# EasyEDA Pro project 仿生青蛙驱动控制板-STM32F1.eprj

# Schematic Schematic1
Create Date: 2024-03-05; Page Name: P1; Project Name: 仿生青蛙驱动控制板-STM32F1; Schematic Name: Schematic1; Update Date: 2024-03-06; Company: 嘉立创EDA; Page Size: A4; Version: V1.0
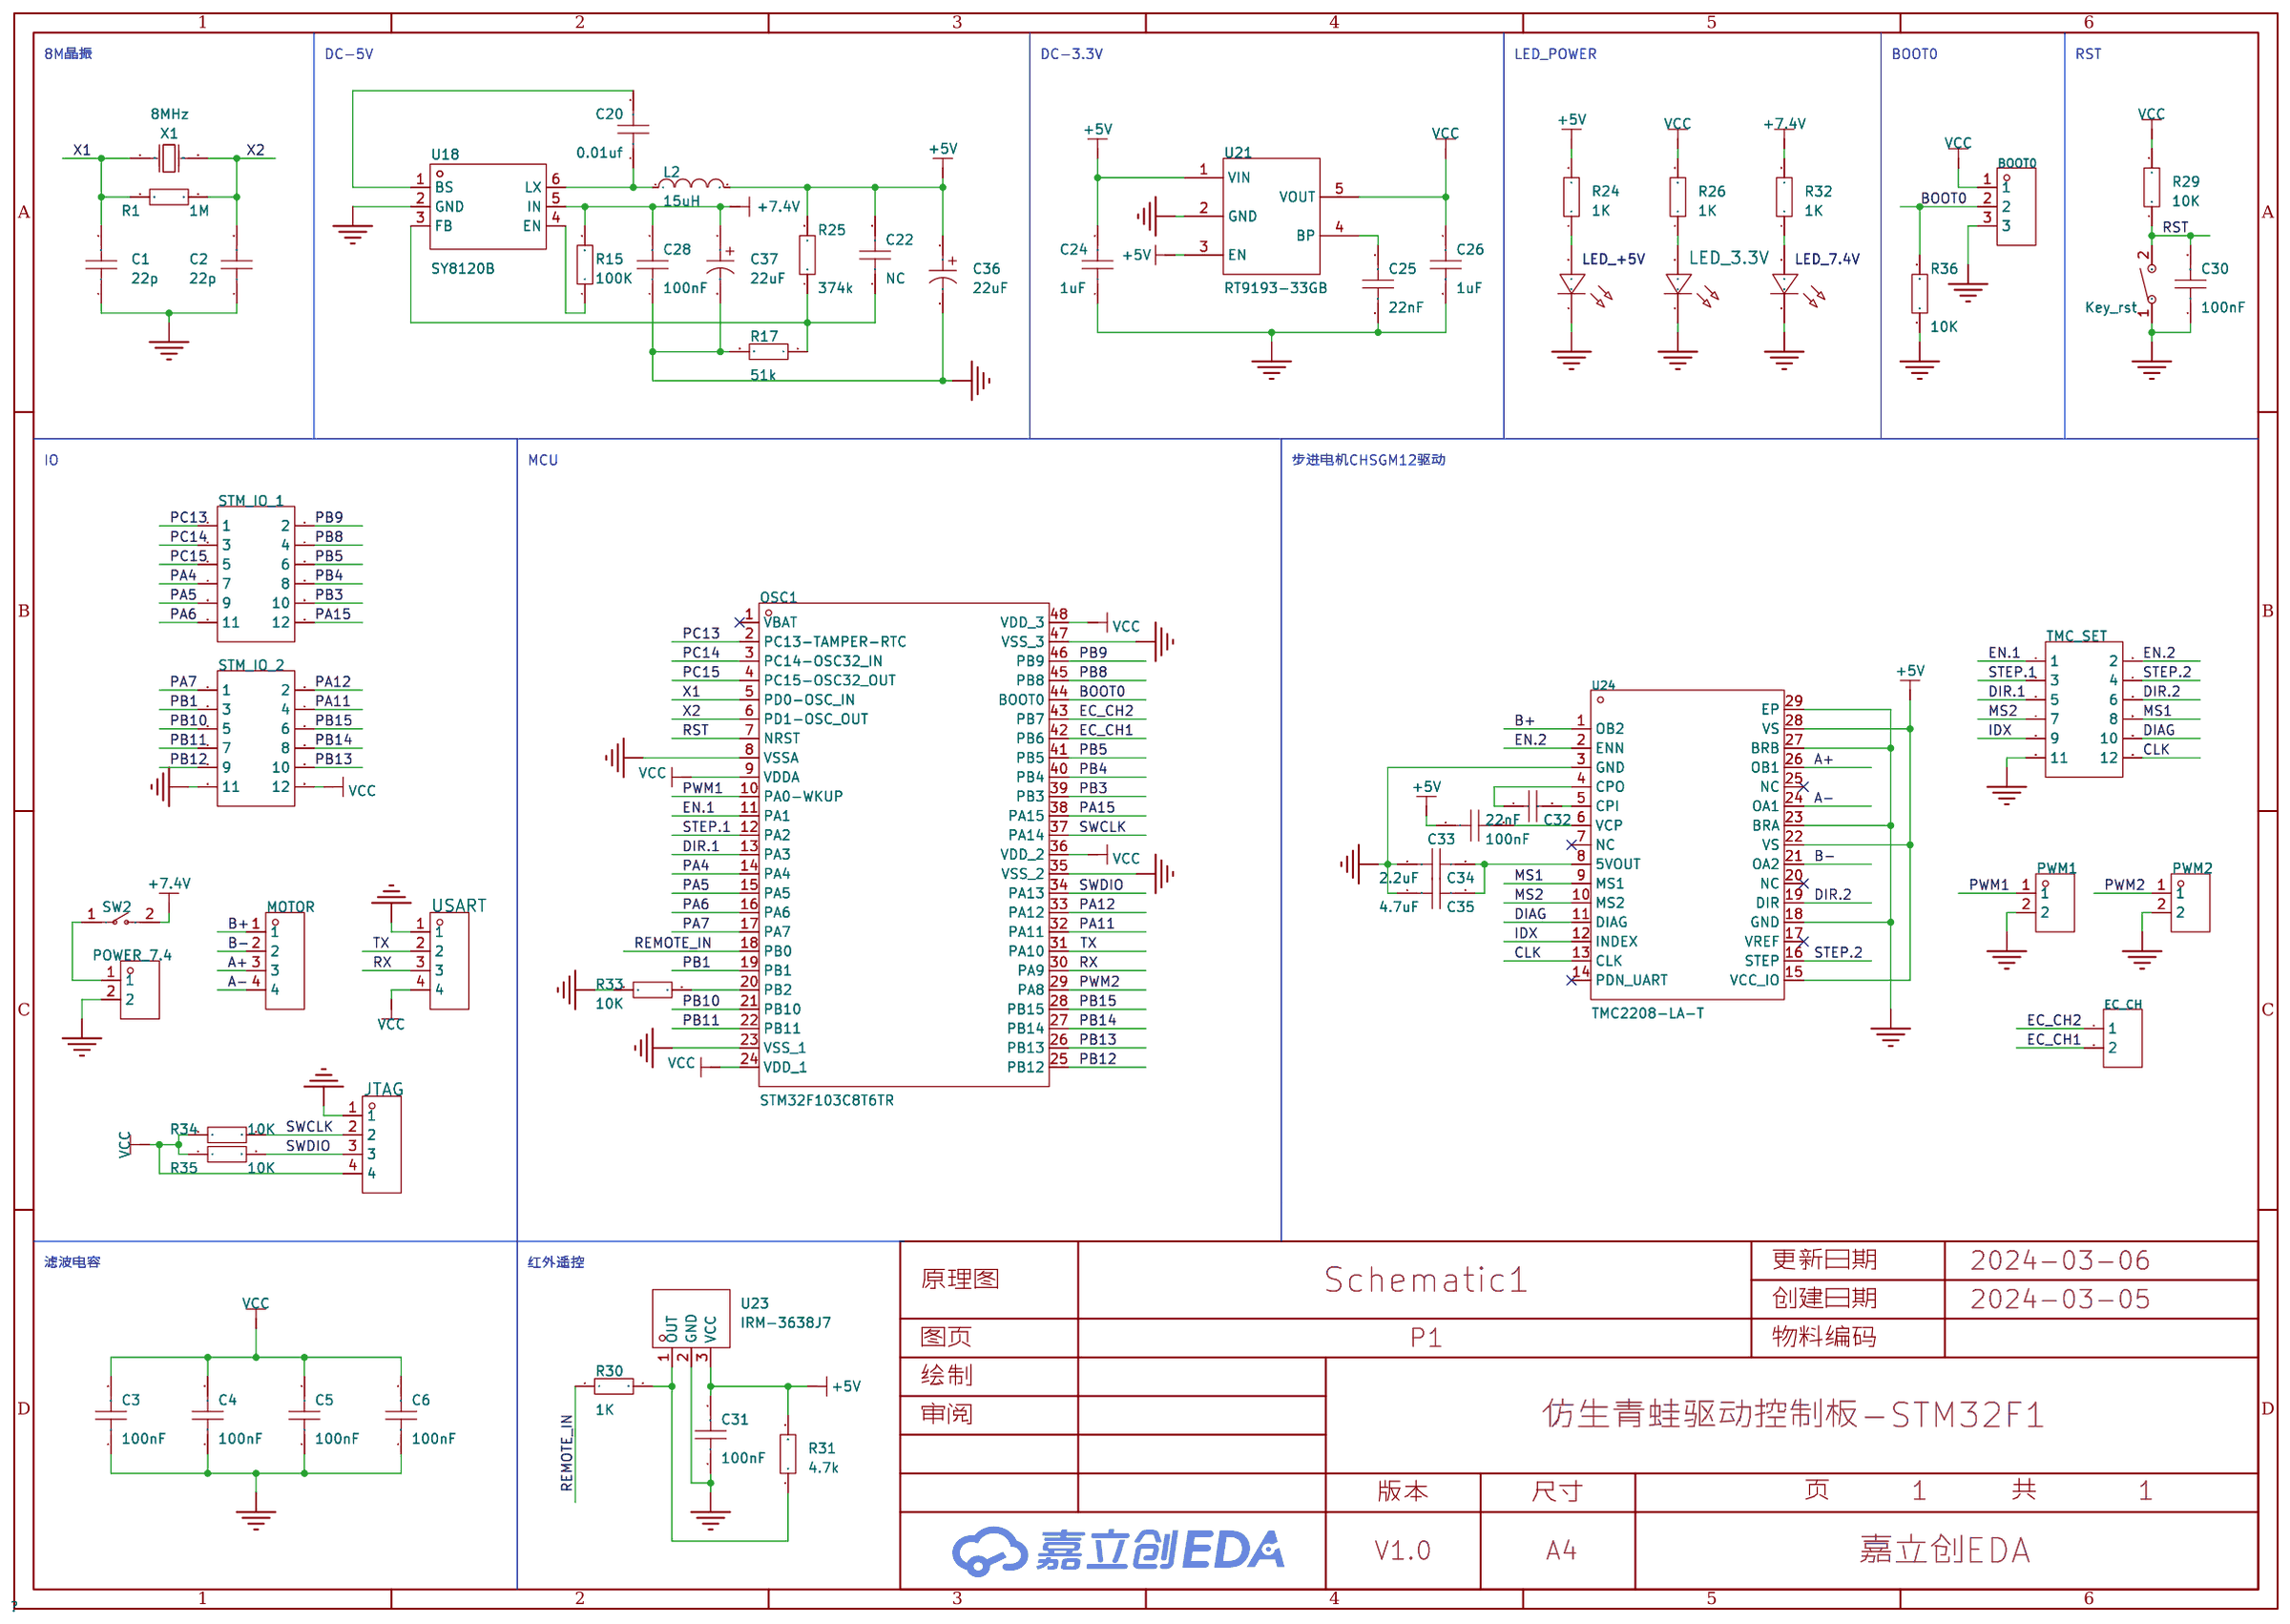
[diagram p0: schematic sheet]

## Parts
BOOT0  -  [HDR-TH_3P-P2.54-V-F]
C1  22p  [c0603]
C2  22p  [c0603]
C3  100nF  [c0603]
C4  100nF  [c0603]
C5  100nF  [c0603]
C6  100nF  [c0603]
C20  0.01uf  [c0603]
C22  NC  [c0603]
C24  1uF  [c0603]
C25  22nF  [c0603]
C26  1uF  [c0603]
C28  100nF  [c0603]
C30  100nF  [c0603]
C31  100nF  [c0603]
C32  22nF  [c0603]
C33  100nF  [c0603]
C34  2.2uF  [c0603]
C35  4.7uF  [c0603]
C36  22uF  [CAP-SMD_BD5.0-L5.3-W5.3-LS6.0-FD]
C37  22uF  [CAP-SMD_BD5.0-L5.3-W5.3-LS6.0-FD]
EC_CH  -  [HDR-TH_2P-P2.54-V-F]
JTAG  -  [HDR-TH_4P-P2.54-V-F]
Key_rst  TS-1092S-B3D2-G  [SW-SMD_L6.1-W3.6-LS7.9]
L2  15uH  [IND-SMD_L7.0-W6.6_FXL0630]
LED_3.3V  -  [LED_0603]
LED_7.4V  -  [LED_0603]
LED_+5V  -  [LED_0603]
MOTOR  ZX-XH2.54-4PZZ  [CONN-TH_4P-P2.50_4PIN]
OSC1  STM32F103C8T6TR  [LQFP-48_L7.0-W7.0-P0.50-LS9.0-BL]
POWER_7.4  ZX-XH2.54-2PZZ  [CONN-TH_2P-P2.50_HX25003-2A]
PWM1  ZX-XH2.54-2PZZ  [CONN-TH_2P-P2.50_HX25003-2A]
PWM2  ZX-XH2.54-2PZZ  [CONN-TH_2P-P2.50_HX25003-2A]
R1  1M  [r0603]
R15  100K  [r0603]
R17  51k  [r0603]
R24  1K  [r0603]
R25  374k  [r0603]
R26  1K  [r0603]
R29  10K  [r0603]
R30  1K  [r0603]
R31  4.7k  [r0603]
R32  1K  [r0603]
R33  10K  [r0603]
R34  10K  [r0603]
R35  10K  [r0603]
R36  10K  [r0603]
STM_IO_1  -  [HDR-TH_12P-P2.54-V-M-R2-C6-S2.54]
STM_IO_2  -  [HDR-TH_12P-P2.54-V-M-R2-C6-S2.54]
SW2  KCD11-2P-R  [SW-TH_2P-L15.0-W10.5-P5.00_KCD11-2P-R]
TMC_SET  -  [HDR-TH_12P-P2.54-V-M-R2-C6-S2.54]
U18  SY8120B  [SOT-23-6_L2.9-W1.6-P0.95-LS2.8-BL]
U21  RT9193-33GB  [SOT-23-5_L3.0-W1.7-P0.95-LS2.8-BL]
U23  IRM-3638J7  [OPTO-TH_IRM-3638MF56]
U24  TMC2208-LA-T  [QFN-28_L5.0-W5.0-P0.50-BL-EP]
USART  -  [HDR-TH_4P-P2.54-V-F]
X1  8MHz  [CRYSTAL-SMD_L5.0-W3.2]

## Library data of the parts
BOOT0 = HDR-F_2.54_1x3P: Supplier Part: C541850; Supplier Footprint: 插件
C1-C6 C24-C26 C28 C30 C31 C33-C35 = CAP_0402: Supplier Footprint: 0402
C20 C22 = CAP_0805: Supplier Footprint: 0805
C32 = 0603B223K500NT: 容值:22nF;精度:±10%;额定电压:50V;材质(温度系数):X7R;; LCSC Part Name: 22nF ±10% 50V; Supplier Part: C77571; Manufacturer: FH(风华); Supplier Footprint: 0603; JLCPCB Part Class: Extended Part; Datasheet: https://atta.szlcsc.com/upload/public/pdf/source/20200305/C486355_26A10D38EF8C2A5C37091D0039909270.pdf; Supplier: LCSC; Tolerance: ±10%; Voltage Rated: 50V; Temperature Coefficient: X7R
C36 C37 = RVT22UF25V67RV0047: 容值:22uF;精度:±20%;额定电压:25V;纹波电流:26mA@120Hz;等效串联电阻:-;; LCSC Part Name: 22uF ±20% 25V; Supplier Part: C2895283; Manufacturer: KNSCHA(科尼盛); Supplier Footprint: SMD,D5xL5.4mm; JLCPCB Part Class: Extended Part; Datasheet: https://atta.szlcsc.com/upload/public/pdf/source/20210913/932E3E330BEA7074461466B23B823DC6.pdf; Supplier: LCSC; Tolerance: ±20%; Rated Voltage: 25V; Ripple Current: 26mA@120Hz; φD: 5mm; L: 5.4mm; Lifetime @ Temp: 2000hrs@105℃; Operating Temperature: -55℃~+105℃
EC_CH = HDR-F_2.54_1x2P: Supplier Part: C49661; Supplier Footprint: 插件
JTAG USART = HDR-F_2.54_1x4P: Supplier Part: C2718488; Supplier Footprint: 插件
Key_rst = TS-1092S-B3D2-G: 电路结构:单刀单掷;按钮形状:矩形按钮;作用力:250gf;安装方式:立贴;开关长度:6.1mm;开关宽度:3.6mm;开关高度:2.5mm;带支架:不带;机械寿命:-;; LCSC Part Name: 6.1*3.6*2.5mm 立贴 轻触开关; Supplier Part: C520860; Manufacturer: Yuandi(元迪); Supplier Footprint: SMD; JLCPCB Part Class: 扩展库; Datasheet: https://atta.szlcsc.com/upload/public/pdf/source/20200424/C520860_DA5AE47D9A9DC527FC720B5FF0895739.pdf; Supplier: LCSC; Circuit: 单刀单掷; Actuator Style: 矩形按钮; Operating Force: 250gf; Mounting Style: 立贴; Switch Length: 6.1mm; Switch Width: 3.6mm; Switch Height: 2.5mm; Strike Gundam: 不带; Actuator/Cap Color: 灰色; Pin Style: 鸥翼型
L2 = FXL0630-150-M: 电感值:15uH;精度:±20%;额定电流:3A;饱和电流(Isat):4.5A;类型:一体成型电感;; LCSC Part Name: 15uH ±20% 4.5A; Supplier Part: C177243; Manufacturer: cjiang(长江微电); Supplier Footprint: SMD,6.6x7mm; JLCPCB Part Class: 扩展库; Datasheet: https://atta.szlcsc.com/upload/public/pdf/source/20230516/3A080F5AF8C87BB81C3BA86E5F60E51A.pdf; Supplier: LCSC; Tolerance: ±20%; Rated Current: 3A; Saturation Current (Isat): 4.5A; DC Resistance (DCR): 115mΩ; Type: 一体成型电感
LED_3.3V = LED_0402-R: Supplier Footprint: 0402
LED_7.4V = LED_0402-B: Supplier Footprint: 0402
LED_+5V = LED_0603-G: Supplier Footprint: 0603
MOTOR = ZX-XH2.54-4PZZ: 插针结构:1x4P;间距:2.54mm;安装方式:直插;参考系列:XH;总PIN数:4P;排数:1;每排PIN数:4;行距:-;额定电流:3A;触头材质:黄铜;触头镀层:锡;工作温度范围:-25℃~+85℃;; Supplier Part: C7429634; Manufacturer: Megastar(兆星); Supplier Footprint: 插件,P=2.54mm; JLCPCB Part Class: Extended Part; Datasheet: https://atta.szlcsc.com/upload/public/pdf/source/20230619/B529A2163E0159A644AB3383D208FB03.pdf; Supplier: LCSC; Pins Structure: 1x4P; Pitch: 2.54mm; Mounting Style: 直插; Reference Series: XH; Number of Pins: 4P; Number of Rows: 1; Number of PINs Per Row: 4; Current Rating (Max): 3A; Contact Material: 黄铜; Contact Plating: 锡; Operating Temperature Range: -25℃~+85℃
OSC1 = STM32F103C8T6TR: CPU内核:CM3;程序存储容量:64KB;RAM总容量:20KB;GPIO端口数量:37;工作电压范围:2V~3.6V;CPU最大主频:72MHz;程序存储器类型:-;; Supplier Part: C2969777; Manufacturer: ST(意法半导体); Supplier Footprint: LQFP-48(7x7); JLCPCB Part Class: 扩展库; Datasheet: https://atta.szlcsc.com/upload/public/pdf/source/20220628/95EE8CB51361BFD20205E6D0986143A8.pdf; Supplier: LCSC; CPU Core: CM3; Program Storage Size: 64KB; RAM Size: 20KB; GPIO Ports Number: 37; Operating Voltage Range: 2V~3.6V; CPU Maximum Speed: 72MHz; Operating Temperature Range: -40℃~+85℃; ADC (Bit): 12bit; Universal Serial Bus: 有; Peripheral/Function: 温度传感器; Watchdog: 有; Infrared Data Association: 有; Low-Voltage Detect: 有; Direct Memory Access: 有; Internal Oscillator: 有
POWER_7.4 PWM1 PWM2 = ZX-XH2.54-2PZZ: 插针结构:1x2P;间距:2.54mm;安装方式:直插;参考系列:XH;总PIN数:2P;排数:1;每排PIN数:2;行距:-;额定电流:3A;触头材质:黄铜;触头镀层:锡;工作温度范围:-25℃~+85℃;; Supplier Part: C7429632; Manufacturer: Megastar(兆星); Supplier Footprint: 插件,P=2.54mm; JLCPCB Part Class: Extended Part; Datasheet: https://atta.szlcsc.com/upload/public/pdf/source/20230619/19BA6947230AA44A04D3EDD65E618FD0.pdf; Supplier: LCSC; Pins Structure: 1x2P; Pitch: 2.54mm; Mounting Style: 直插; Reference Series: XH; Number of Pins: 2P; Number of Rows: 1; Number of PINs Per Row: 2; Current Rating (Max): 3A; Contact Material: 黄铜; Contact Plating: 锡; Operating Temperature Range: -25℃~+85℃
R1 R26 R29-R35 = Res_0402: Supplier Footprint: 0402
R15 R17 R24 R25 = Res_0805: Supplier Footprint: 0805
R36 = Res_0603: Supplier Footprint: 0603
STM_IO_1 STM_IO_2 TMC_SET = HDR-F_2.54_2x6: Supplier Part: C92270; Supplier Footprint: 插件
SW2 = KCD11-2P-R: 带灯:无;引脚样式:焊片;额定电流:3A;额定电压(AC):250V;额定电压(DC):-;电路结构:单刀单掷;机械寿命:1万次;; LCSC Part Name: 10.5*15mm 两脚两档跷板开关 红钮; Supplier Part: C5884414; Manufacturer: SHOU HAN(首韩); Supplier Footprint: 插件; JLCPCB Part Class: Extended Part; Datasheet: https://atta.szlcsc.com/upload/public/pdf/source/20230506/CD06DFDE35C8048D34175BFF4AF6A2C2.pdf; Supplier: LCSC; Switch Length: 15mm; Switch Width: 10.5mm; Switch Height: 17.2mm; Actuator Type: 凹面弯曲; With Lamp: 无; Pin Style: 焊片; Actuator Color: 红色; Contact Current: 3A; Voltage Rating (AC): 250V; Circuit: 单刀单掷; Mechanical Life: 1万次; Operating Temperature: 0℃~+125℃; Actuator Identifier: - O
U18 = SY8120B: LCSC Part Name: 2A, 18V, 600KHz同步降压转换器; Supplier Part: C5330397; Manufacturer: Slkor(萨科微); Supplier Footprint: SOT-23-6; JLCPCB Part Class: 扩展库; Datasheet: https://atta.szlcsc.com/upload/public/pdf/source/20221213/05E3E36F9B4BD6CBAE1D86C5271B65DD.pdf; Supplier: LCSC
U21 = RT9193-33GB: 输出类型:固定;最大输入电压:5.5V;输出电压:3.3V;最大输出电流:300mA;电源纹波抑制比(PSRR):70dB;输出极性:正极;; LCSC Part Name: 输入5.5V 输出3.3V 300mA; Supplier Part: C15651; Manufacturer: RICHTEK(立锜); Supplier Footprint: SOT-23-5; JLCPCB Part Class: 扩展库; Datasheet: https://atta.szlcsc.com/upload/public/pdf/source/20130730/1457706628575.pdf; Supplier: LCSC; Output Type: 固定; Maximum Input Voltage: 5.5V; Output Voltage: 3.3V; MAX Output Current: 300mA; Power Supply Rejection Ratio (PSRR): 70dB; Dropout Voltage: 300mV@(300mA); standby current: 130uA; Operating Temperature: -40℃~+125℃; Output Polarity: 正极; Number of Outputs: 1
U23 = IRM-3638J7: 工作电压:4.5V~5.5V;接收角度:±35°;; LCSC Part Name: 红外遥控接收头IRM-3638J7; Supplier Part: C19189533; Manufacturer: EVERLIGHT(亿光); Supplier Footprint: 插件,P=2.54mm; Datasheet: https://atta.szlcsc.com/upload/public/pdf/source/20231108/FFE1B102FF7B11977C28729764C84A78.pdf; Supplier: LCSC; Supply Voltage: 4.5V~5.5V; Half Angle: ±35°
U24 = TMC2208-LA-T: Supplier Part: C115944; Manufacturer: TRINAMIC; Supplier Footprint: QFN-28-EP(5x5); JLCPCB Part Class: 扩展库; Datasheet: https://atta.szlcsc.com/upload/public/pdf/source/20191203/C465950_1EAB350E0A7C8C5F0CDF7EA169BA06CB.pdf; Supplier: LCSC
X1 = X50328MSB2GI: 晶振类型:贴片晶振;频率:8MHz;常温频差:±10ppm;外接负载电容:20pF;频率稳定度(全温):±50ppm;; LCSC Part Name: 8MHz ±10ppm 20pF YSX530GA; Supplier Part: C115962; Manufacturer: YXC(扬兴晶振); Supplier Footprint: SMD5032; JLCPCB Part Class: Basic Part; Datasheet: https://atta.szlcsc.com/upload/public/pdf/source/20230220/0EBFFB9D6D8CE6A211407822BBB6C516.pdf; Supplier: LCSC; Crystal Type: 贴片晶振; Normal temperature Frequency Tolerance: ±10ppm; External load capacitor: 20pF; Frequency Stability(Full temperature range): ±50ppm; Operating Temperature: -40℃~+85℃

## Nets
+5V: C22.2 C24.2 C31.2 C33.1 C36.1 L2.2 R24.2 R25.2 R31.2 U21.1(VIN) U21.3(EN) U23.3(VCC) U24.15(VCC_IO) U24.22(VS) U24.28(VS)
+7.4V: C28.2 C37.1 R15.2 R32.2 SW2.2 U18.5(IN)
GND: BOOT0.3 C1.1 C2.1 C3.1 C4.1 C5.1 C6.1 C24.1 C25.2 C26.2 C28.1 C30.1 C31.1 C34.1 C35.1 C36.2 C37.2 JTAG.1 Key_rst.1 LED_3.3V.1(C) LED_7.4V.1(C) LED_+5V.1(C) OSC1.8(VSSA) OSC1.23(VSS_1) OSC1.35(VSS_2) OSC1.47(VSS_3) POWER_7.4.2 PWM1.2 PWM2.2 R17.2 R33.1 R36.1 STM_IO_2.11 TMC_SET.11 U18.2(GND) U21.2(GND) U23.2(GND) U24.3(GND) U24.18(GND) U24.23(BRA) U24.27(BRB) U24.29(EP) USART.1
VCC: BOOT0.1 C3.2 C4.2 C5.2 C6.2 C26.1 JTAG.4 OSC1.9(VDDA) OSC1.24(VDD_1) OSC1.36(VDD_2) OSC1.48(VDD_3) R26.2 R29.2 R34.1 R35.1 STM_IO_2.12 U21.5(VOUT) USART.4
A+: MOTOR.3 U24.26(OB1)
A-: MOTOR.4 U24.24(OA1)
B+: MOTOR.1 U24.1(OB2)
B-: MOTOR.2 U24.21(OA2)
BOOT0: BOOT0.2 OSC1.44(BOOT0) R36.2
CLK: TMC_SET.12 U24.13(CLK)
DIAG: TMC_SET.10 U24.11(DIAG)
DIR.1: OSC1.13(PA3) TMC_SET.5
DIR.2: TMC_SET.6 U24.19(DIR)
EC_CH1: EC_CH.2 OSC1.42(PB6)
EC_CH2: EC_CH.1 OSC1.43(PB7)
EN.1: OSC1.11(PA1) TMC_SET.1
EN.2: TMC_SET.2 U24.2(ENN)
IDX: TMC_SET.9 U24.12(INDEX)
MS1: TMC_SET.8 U24.9(MS1)
MS2: TMC_SET.7 U24.10(MS2)
PA4: OSC1.14(PA4) STM_IO_1.7
PA5: OSC1.15(PA5) STM_IO_1.9
PA6: OSC1.16(PA6) STM_IO_1.11
PA7: OSC1.17(PA7) STM_IO_2.1
PA11: OSC1.32(PA11) STM_IO_2.4
PA12: OSC1.33(PA12) STM_IO_2.2
PA15: OSC1.38(PA15) STM_IO_1.12
PB1: OSC1.19(PB1) STM_IO_2.3
PB3: OSC1.39(PB3) STM_IO_1.10
PB4: OSC1.40(PB4) STM_IO_1.8
PB5: OSC1.41(PB5) STM_IO_1.6
PB8: OSC1.45(PB8) STM_IO_1.4
PB9: OSC1.46(PB9) STM_IO_1.2
PB10: OSC1.21(PB10) STM_IO_2.5
PB11: OSC1.22(PB11) STM_IO_2.7
PB12: OSC1.25(PB12) STM_IO_2.9
PB13: OSC1.26(PB13) STM_IO_2.10
PB14: OSC1.27(PB14) STM_IO_2.8
PB15: OSC1.28(PB15) STM_IO_2.6
PC13: OSC1.2(PC13-TAMPER-RTC) STM_IO_1.1
PC14: OSC1.3(PC14-OSC32_IN) STM_IO_1.3
PC15: OSC1.4(PC15-OSC32_OUT) STM_IO_1.5
PWM1: OSC1.10(PA0-WKUP) PWM1.1
PWM2: OSC1.29(PA8) PWM2.1
REMOTE_IN: OSC1.18(PB0) R30.1
RST: C30.2 Key_rst.2 OSC1.7(NRST) R29.1
RX: OSC1.30(PA9) USART.3
STEP.1: OSC1.12(PA2) TMC_SET.3
STEP.2: TMC_SET.4 U24.16(STEP)
SWCLK: JTAG.2 OSC1.37(PA14) R34.2
SWDIO: JTAG.3 OSC1.34(PA13) R35.2
TX: OSC1.31(PA10) USART.2
X1: C1.2 OSC1.5(PD0-OSC_IN) R1.1 X1.1(OSC1)
X2: C2.2 OSC1.6(PD1-OSC_OUT) R1.2 X1.2(OSC2)
$1N1980: C20.1 L2.1 U18.6(LX)
$1N1981: C20.2 U18.1(BS)
$1N1982: R15.1 U18.4(EN)
$1N3570: C25.1 U21.4(BP)
$1N6287: R30.2 R31.1 U23.1(OUT)
$1N6675: OSC1.20(PB2) R33.2
$1N7825: C32.2 U24.5(CPI)
$1N7836: C32.1 U24.4(CPO)
$1N7919: C33.2 U24.6(VCP)
$1N8038: C34.2 C35.2 U24.8(5VOUT)
$1N10736: C22.1 R17.1 R25.1 U18.3(FB)
$1N12968: POWER_7.4.1 SW2.1
Net-(LED_3.3V-2): LED_3.3V.2(A) R26.1
Net-(LED_7.4V-2): LED_7.4V.2(A) R32.1
Net-(LED_+5V-2): LED_+5V.2(A) R24.1

Not connected (* = marked no-connect by the designer): OSC1 1(VBAT)*; U24 7(NC)* 14(PDN_UART)* 17(VREF)* 20(NC)* 25(NC)*

## Notes on the sheet
- 8M晶振
- DC-5V
- DC-3.3V
- LED_POWER
- BOOT0
- RST
- IO
- MCU
- 步进电机CHSGM12驱动
- 滤波电容
- 红外遥控

# Board PCB1
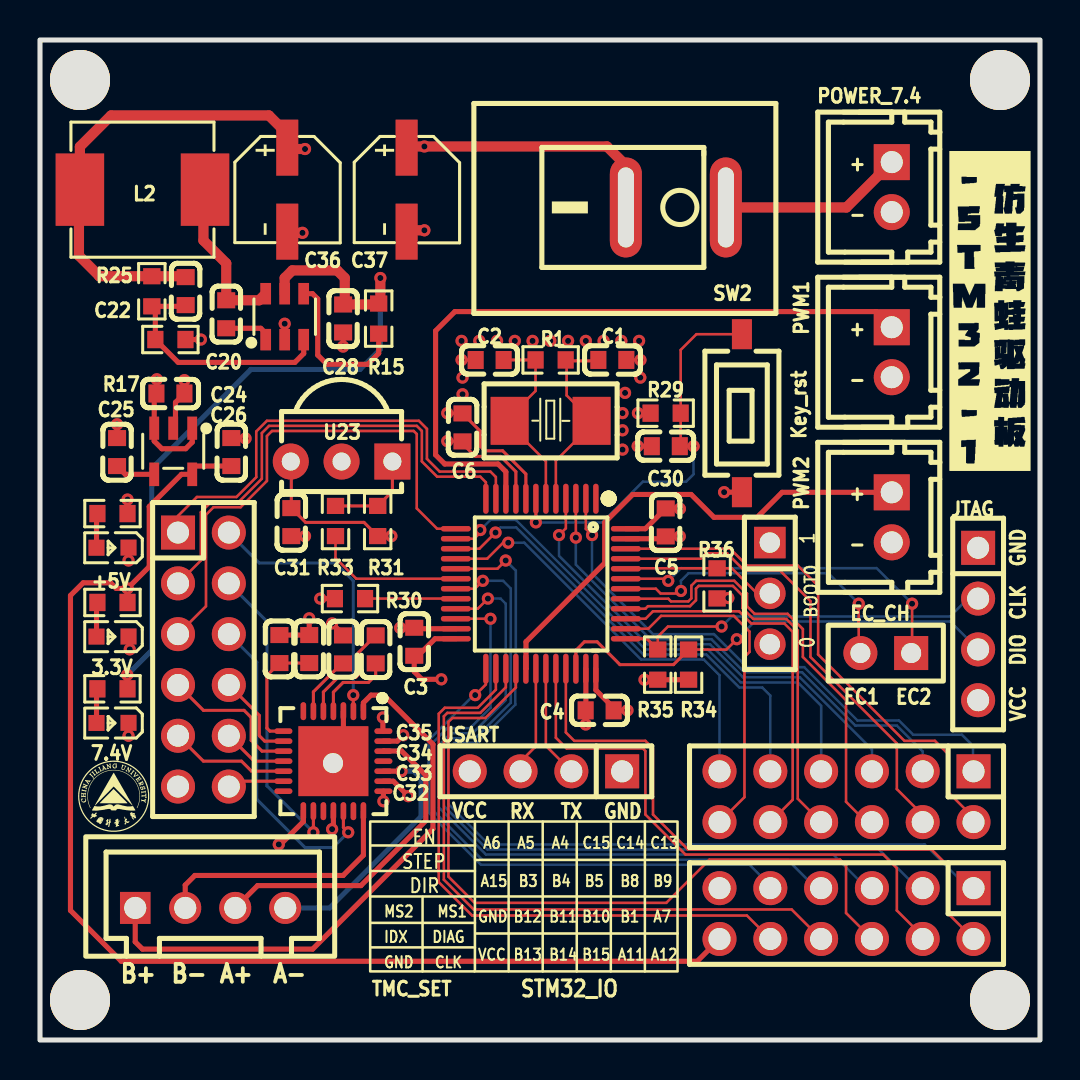
[diagram p1: board, top side]
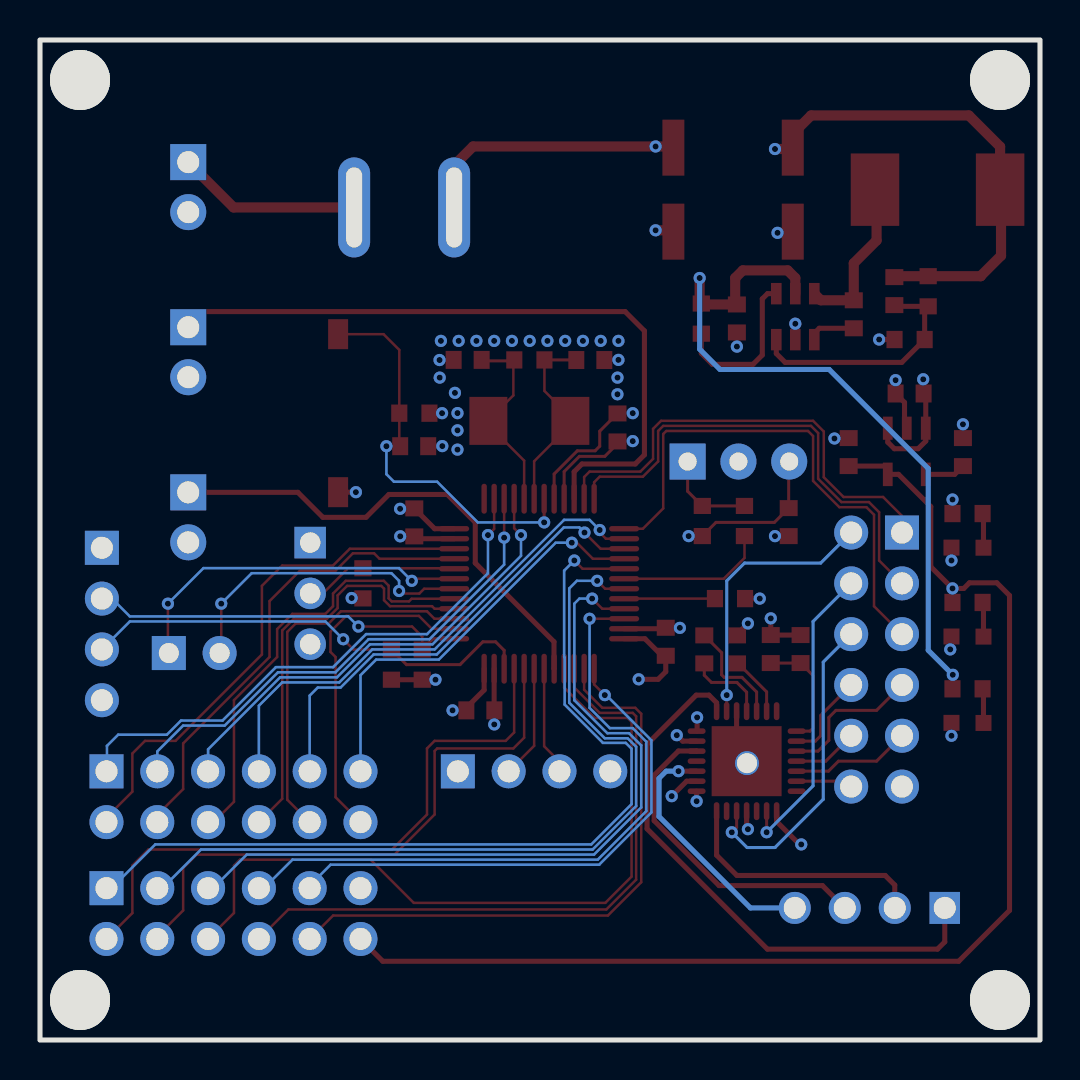
[diagram p2: board, bottom side, seen from below]

Outline 50 x 50 mm; copper layers: Top Layer, POWER, GND, Bottom Layer. Coordinates in mm from the lower left corner of the outline.
Outline path: rectangle 0,50 50,0
Stack: Top Layer 0.035mm 外层铜厚1oz / Dielectric1 0.2104mm 7628 RC49% 8.6mil / POWER 0.0152mm 内层铜厚 / Dielectric2 1.065mm 1.1mm H/HOZ 含铜 / GND 0.0152mm 内层铜厚 / Dielectric3 0.2104mm 7628 RC49% 8.6mil / Bottom Layer 0.035mm 外层铜厚1oz

## Design rules (mm)
net RX: USART
net TX: USART
template: JLCPCB Capability(Two Layers Board)
spacing copperThickness1oz (default): track to track 0.102, other pairs 0.152 to 0.3
spacing copperThickness2oz: track to track 0.203, other pairs 0.152 to 0.3
track width copperThickness1oz (default): min 0.127, default 0.254, max 2.54
track width copperThickness2oz: min 0.203, default 0.254, max 2.54
differential pair differentialPair (default): width min 0.127, default 0.254, max 2.54; gap min 0.152, default 0.152
via viaSize (default): diameter min 0.5, default 0.61, max 10; hole min 0.3, default 0.305, max 6.3

## Placement (name value [footprint] x y rotation side)
3.3V  -  [LED_0603]  3.58 20.17 180 top
7.4V  -  [LED_0603]  3.58 15.85 180 top
+5V  -  [LED_0603]  3.58 24.61 180 top
BOOT0  -  [HDR-TH_3P-P2.54-V-F]  36.49 22.33 270 top
C1  22p  [c0603]  28.62 34 180 top
C2  22p  [c0603]  22.48 34 0 top
C3  100nF  [c0603]  18.71 19.91 270 top
C4  100nF  [c0603]  27.98 16.48 0 top
C5  100nF  [c0603]  31.28 25.88 90 top
C6  100nF  [c0603]  21.12 30.63 270 top
C20  0.01uf  [c0603]  9.31 36.29 270 top
C22  NC  [c0603]  7.28 37.44 90 top
C24  1uF  [c0603]  6.52 32.33 180 top
C25  22nF  [c0603]  3.85 29.4 90 top
C26  1uF  [c0603]  9.57 29.4 90 top
C28  100nF  [c0603]  15.16 36.08 90 top
C30  100nF  [c0603]  31.29 29.69 0 top
C31  100nF  [c0603]  12.57 25.89 90 top
C32  22nF  [c0603]  16.78 19.53 90 top
C33  100nF  [c0603]  15.15 19.53 270 top
C34  2.2uF  [c0603]  13.46 19.55 270 top
C35  4.7uF  [c0603]  11.97 19.55 270 top
C36  22uF  [CAP-SMD_BD5.0-L5.3-W5.3-LS6.0-FD]  12.36 42.52 270 top
C37  22uF  [CAP-SMD_BD5.0-L5.3-W5.3-LS6.0-FD]  18.33 42.52 270 top
EC_CH  -  [HDR-TH_2P-P2.54-V-F]  42.29 19.35 180 top
JTAG  -  [HDR-TH_4P-P2.54-V-F]  46.91 20.8 270 top
Key_rst  TS-1092S-B3D2-G  [SW-SMD_L6.1-W3.6-LS7.9]  35.09 31.34 90 top
L2  15uH  [IND-SMD_L7.0-W6.6_FXL0630]  5.12 42.52 0 top
MOTOR  ZX-XH2.54-4PZZ  [CONN-TH_4P-P2.50_4PIN]  8.51 6.6 0 top
NOREF  -  [Pad_e2756]  14.65 13.84 0 top
NOREF#2  -  [Pad_e2042]  48 2 0 top
NOREF#3  -  [Pad_e2038]  2 48 0 top
NOREF#4  -  [Pad_e2040]  48 48 0 top
NOREF#5  -  [Pad_e2041]  2 2 0 top
OSC1  STM32F103C8T6TR  [LQFP-48_L7.0-W7.0-P0.50-LS9.0-BL]  25.04 22.81 180 top
POWER_7.4  ZX-XH2.54-2PZZ  [CONN-TH_2P-P2.50_HX25003-2A]  42.59 42.64 270 top
PWM1  ZX-XH2.54-2PZZ  [CONN-TH_2P-P2.50_HX25003-2A]  42.59 34.39 270 top
PWM2  ZX-XH2.54-2PZZ  [CONN-TH_2P-P2.50_HX25003-2A]  42.59 26.13 270 top
R1  1M  [r0603]  25.53 34 180 top
R15  100K  [r0603]  16.93 36.07 90 top
R17  51k  [r0603]  6.52 35.02 0 top
R24  1K  [r0603]  3.62 26.32 0 top
R25  374k  [r0603]  5.59 37.44 90 top
R26  1K  [r0603]  3.62 21.88 0 top
R29  10K  [r0603]  31.28 31.34 180 top
R30  1K  [r0603]  14.78 25.95 90 top
R31  4.7k  [r0603]  16.88 25.95 270 top
R32  1K  [r0603]  3.62 17.56 0 top
R33  10K  [r0603]  15.5 22.07 0 top
R34  10K  [r0603]  30.89 18.77 90 top
R35  10K  [r0603]  32.43 18.77 90 top
R36  10K  [r0603]  33.85 22.83 90 top
STM_IO_1  -  [HDR-TH_12P-P2.54-V-M-R2-C6-S2.54]  40.33 12.16 180 top
STM_IO_2  -  [HDR-TH_12P-P2.54-V-M-R2-C6-S2.54]  40.33 6.32 180 top
SW2  KCD11-2P-R  [SW-TH_2P-L15.0-W10.5-P5.00_KCD11-2P-R]  31.79 41.63 180 top
TMC_SET  -  [HDR-TH_12P-P2.54-V-M-R2-C6-S2.54]  8.17 19.02 270 top
U18  SY8120B  [SOT-23-6_L2.9-W1.6-P0.95-LS2.8-BL]  12.24 36.17 0 top
U21  RT9193-33GB  [SOT-23-5_L3.0-W1.7-P0.95-LS2.8-BL]  6.66 29.44 180 top
U23  IRM-3638J7  [OPTO-TH_IRM-3638MF56]  15.08 28.92 180 top
U24  TMC2208-LA-T  [QFN-28_L5.0-W5.0-P0.50-BL-EP]  14.67 13.94 180 top
USART  -  [HDR-TH_4P-P2.54-V-F]  25.3 13.43 180 top
X1  8MHz  [CRYSTAL-SMD_L5.0-W3.2]  25.53 30.96 180 top

## Footprints (pads in the part's own frame, mm; a bottom-side part is the same pattern mirrored in y, then rotated)
c0603
  rect 0.8x0.9 smd: 1(-0.7,0) 2(0.7,0)
CAP-SMD_BD5.0-L5.3-W5.3-LS6.0-FD
  rect 2.8x1.1 smd: 1(-2.1,0) 2(2.1,0)
CONN-TH_2P-P2.50_HX25003-2A
  rect 1.8x1.8 hole 1.1: 1(-1.25,0)
  round 1.8 hole 1.1: 2(1.25,0)
CONN-TH_4P-P2.50_4PIN
  rect 1.524x1.6 hole 1.1: 1(-3.75,0)
  round 1.6 hole 1.1: 2(-1.25,0) 3(1.25,0) 4(3.75,0)
CRYSTAL-SMD_L5.0-W3.2
  rect 1.9x2.4 smd: 1(-2.05,0) 2(2.05,0)
HDR-TH_2P-P2.54-V-F
  rect 1.7x1.7 hole 1: 1(-1.27,0)
  round 1.7 hole 1: 2(1.27,0)
HDR-TH_3P-P2.54-V-F
  rect 1.575x1.575 hole 1.02: 1(-2.54,0)
  round 1.575 hole 1.02: 2(0,0) 3(2.54,0)
HDR-TH_4P-P2.54-V-F
  rect 1.7x1.7 hole 1.1: 1(-3.81,0)
  round 1.7 hole 1.1: 2(-1.27,0) 3(1.27,0) 4(3.81,0)
HDR-TH_12P-P2.54-V-M-R2-C6-S2.54
  rect 1.7x1.7 hole 1.1: 1(-6.35,-1.27)
  round 1.7 hole 1.1: 2(-6.35,1.27) 3(-3.81,-1.27) 4(-3.81,1.27) 5(-1.27,-1.27) 6(-1.27,1.27) 7(1.27,-1.27) 8(1.27,1.27) 9(3.81,-1.27) 10(3.81,1.27) 11(6.35,-1.27) 12(6.35,1.27)
IND-SMD_L7.0-W6.6_FXL0630
  rect 2.424x3.62 smd: 1(3.128,0) 2(-3.128,0)
LED_0603
  rect 0.8x0.8 smd: 1(-0.851,-0.01) 2(0.75,-0.005)
LQFP-48_L7.0-W7.0-P0.50-LS9.0-BL
  oval 0.27x1.5 smd: 1(-2.75,-4.25) 2(-2.25,-4.25) 3(-1.75,-4.25) 4(-1.25,-4.25) 5(-0.75,-4.25) 6(-0.25,-4.25) 7(0.25,-4.25) 8(0.75,-4.25) 9(1.25,-4.25) 10(1.75,-4.25) 11(2.25,-4.25) 12(2.75,-4.25) 25(2.75,4.25) 26(2.25,4.25) 27(1.75,4.25) 28(1.25,4.25) 29(0.75,4.25) 30(0.25,4.25) 31(-0.25,4.25) 32(-0.75,4.25) 33(-1.25,4.25) 34(-1.75,4.25) 35(-2.25,4.25) 36(-2.75,4.25)
  oval 1.5x0.27 smd: 13(4.25,-2.75) 14(4.25,-2.25) 15(4.25,-1.75) 16(4.25,-1.25) 17(4.25,-0.75) 18(4.25,-0.25) 19(4.25,0.25) 20(4.25,0.75) 21(4.25,1.25) 22(4.25,1.75) 23(4.25,2.25) 24(4.25,2.75) 37(-4.25,2.75) 38(-4.25,2.25) 39(-4.25,1.75) 40(-4.25,1.25) 41(-4.25,0.75) 42(-4.25,0.25) 43(-4.25,-0.25) 44(-4.25,-0.75) 45(-4.25,-1.25) 46(-4.25,-1.75) 47(-4.25,-2.25) 48(-4.25,-2.75)
OPTO-TH_IRM-3638MF56
  rect 1.8x1.8 hole 0.9: 1(-2.54,0)
  round 1.8 hole 0.9: 2(0,0) 3(2.54,0)
Pad_e2038
  round 3 hole 3: 1(0,0)
Pad_e2040
  round 3 hole 3: 1(0,0)
Pad_e2041
  round 3 hole 3: 1(0,0)
Pad_e2042
  round 3 hole 3: 1(0,0)
Pad_e2756
  round 1.2 hole 1: 2(0,0)
QFN-28_L5.0-W5.0-P0.50-BL-EP
  oval 0.28x0.9 smd: 1(-1.502,-2.5) 2(-1.001,-2.5) 3(-0.5,-2.5) 4(0,-2.5) 5(0.5,-2.5) 6(1,-2.5) 7(1.501,-2.5) 15(1.501,2.5) 16(1,2.5) 17(0.5,2.5) 18(0,2.5) 19(-0.5,2.5) 20(-1.001,2.5) 21(-1.502,2.5)
  oval 0.9x0.28 smd: 8(2.5,-1.502) 9(2.5,-1.001) 10(2.5,-0.5) 11(2.5,0) 12(2.5,0.5) 13(2.5,1) 14(2.5,1.501) 22(-2.5,1.501) 23(-2.5,1) 24(-2.5,0.5) 25(-2.5,0) 26(-2.5,-0.5) 27(-2.5,-1.001) 28(-2.5,-1.502)
  rect 3.5x3.5 smd: 29(0,0)
r0603
  rect 0.806x0.864 smd: 1(-0.753,0) 2(0.753,0)
SOT-23-5_L3.0-W1.7-P0.95-LS2.8-BL
  rect 0.49x1.157 smd: 1(-0.95,-1.153) 2(0,-1.153) 3(0.95,-1.153)
  rect 0.49x1.175 smd: 4(0.95,1.153) 5(-0.95,1.153)
SOT-23-6_L2.9-W1.6-P0.95-LS2.8-BL
  rect 0.532x1.072 smd: 1(-0.95,-1.149) 2(0,-1.149) 3(0.95,-1.149) 4(0.95,1.149) 5(0,1.149) 6(-0.95,1.149)
SW-SMD_L6.1-W3.6-LS7.9
  rect 1.5x1 smd: 1(-3.95,0) 2(3.95,0)
SW-TH_2P-L15.0-W10.5-P5.00_KCD11-2P-R
  oval 1.6x5 hole 0.8x4: 1(-2.5,0) 2(2.5,0)

## Nets
As in the schematic, except:
GND: 3.3V.1 7.4V.1 +5V.1 BOOT0.3 C1.1 C2.1 C3.1 C4.1 C5.1 C6.1 C24.1 C25.2 C26.2 C28.1 C30.1 C31.1 C34.1 C35.1 C36.2 C37.2 JTAG.1 Key_rst.1 NOREF.2 NOREF#2.1 NOREF#3.1 NOREF#4.1 NOREF#5.1 OSC1.8 OSC1.23 OSC1.35 OSC1.47 POWER_7.4.2 PWM1.2 PWM2.2 R17.2 R33.1 R36.1 STM_IO_2.11 TMC_SET.11 U18.2 U21.2 U23.2 U24.3 U24.18 U24.23 U24.27 U24.29 USART.1
$1N1985: +5V.2 R24.1
$1N3715: 3.3V.2 R26.1
$1N6481: 7.4V.2 R32.1

Pads without a net: OSC1 1; U24 7 14 17 20 25

## Via types
v1: diameter 0.61, hole 0.305, Top Layer to Bottom Layer, 85 vias

## Routing (per net, layer and track width the routed paths; a pad name or vN(x,y) marks a point on that pad's centre or on a via; arc(x,y) is an arc through that point)
+5V: length 43.1
  Top Layer w0.152: v1(17.57,25.2) R31.2 16.2,25.88 13.28,25.88 C31.2 12.57,28.9 U23.3
  Top Layer w0.254: R24.2 v1(4.38,27.02) ; U24.28 17.15,15.47 v1(17.15,16.13) ; C33.1 15.15,20.28 v1(14.6,20.83) ; v1(11.94,9.78) 12.03,9.78 13.17,10.92 U24.15 ; U24.22 v1(17.17,11.94) ; U21.1 7.61,29.89 7.28,29.56 6.09,29.56 5.71,29.94 U21.3 5.71,32.22 C24.2 5.82,32.99
  Top Layer w0.508: v1(13.25,44.55) 12.43,44.55 C36.1 12.36,45.31 11.44,46.23 3.56,46.23 2,44.67 L2.2 1.95,42.47 1.95,39.22 2.96,38.2 2.96,38.19 R25.2 7.24,38.19 C22.2
  vias: v1(5.84,33.03)
+7.4V: length 51
  Top Layer w0.254: v1(4.36,18.26) 4.36,17.57 R32.2
  Top Layer w0.508: U18.5 12.24,38.1 12.62,38.48 14.86,38.48 15.24,38.1 15.24,36.86 C28.2 16.89,36.78 16.93,36.82 17.02,36.91 v1(17.02,38.1) ; C37.1 18.39,44.68 v1(19.22,44.68) 28.35,44.68 29.29,43.73 SW2.2
  Bottom Layer w0.254: v1(4.36,18.26) 5.59,19.49 5.59,28.58 10.54,33.53 16,33.53 17.02,34.54 v1(17.02,38.1)
GND: length 38.2
  Top Layer w0.152: 21.12,34.01 21.13,34 C2.1 ; C1.1 29.89,34 ; v1(20.36,31.34) 21.11,31.34 C6.1 22.01,30.44 22.01,29.69 22.24,29.46 23.13,29.46 24.29,28.3 24.29,27.06 ; C31.1 v1(13.25,25.19)
  Top Layer w0.254: v1(12.24,35.81) U18.2 ; v1(13.46,21.08) C34.1 C35.1 ; 31.92,25.18 C5.1 31.17,25.06 29.29,25.06 ; v1(7.22,32.99) C24.1 6.77,31.88 6.77,30.7 U21.2 ; C25.2 3.85,30.71 ; OSC1.35 27.29,16.49 C4.1 27.28,15.85 ; C28.1 v1(15.16,34.67) ; 3.3V.1 4.49,20.11 v1(4.49,19.53) ; 7.4V.1 v1(4.43,15.21) ; OSC1.23 18.76,20.56 C3.1 18.08,20.61 ; NOREF.2 15.17,14.36 U24.3 ; 17.17,14.94 17.86,14.94 v1(18.16,15.24) ; v1(8.04,35.02) R17.2 ; U24.18 14.67,10.61 v1(14.6,10.54) ; C30.1 30.01,29.69 ; C26.2 10.2,30.1 ; 17.17,12.94 17.67,12.94 v1(18.41,12.19) ; 14.75,22.07 v1(14.01,22.07) ; 35.09,27.39 v1(34.21,27.39) ; +5V.1 v1(4.43,23.97) ; R36.1 34.42,22.08
  Top Layer w0.508: C36.2 12.42,40.36 v1(13.12,40.36) ; v1(19.22,40.48) 18.4,40.48 C37.2
  vias: v1(3.85,30.79) v1(10.28,30.08) v1(18.01,20.61) v1(21.08,34.96) v1(21.08,34) v1(21.12,33.12) v1(21.13,32.29) v1(21.97,34.96) v1(22.85,34.96) v1(23.74,34.96) v1(24.63,34.96) v1(25.52,34.96) v1(26.4,34.96) v1(27.29,34.96) v1(27.29,15.78) v1(28.18,34.96) v1(29.07,34.96) v1(29.13,31.34) v1(29.13,30.48) v1(29.13,29.52) v1(29.25,32.36) v1(29.88,29.7) v1(29.95,34.96) v1(30.02,34) v1(30.01,33.12) v1(31.99,25.18) v1(34.42,22.1)
VCC: length 82.4
  Top Layer w0.152: 23.79,27.06 23.79,28.42 23.03,29.18 21.76,29.18 21.12,29.82 C6.2 21.11,29.94 v1(20.36,29.94)
  Top Layer w0.254: OSC1.48 30.27,25.56 C5.2 31.92,26.58 ; OSC1.36 27.79,17.5 28.68,16.61 C4.2 29.25,16.48 ; R26.2 v1(4.38,22.58) ; v1(4.38,22.58) 5.46,23.66 5.46,26.67 7.07,28.28 U21.5 7.61,28.7 C26.1 ; v1(4.38,22.58) 3.81,22.58 3.53,22.86 2.16,22.86 1.52,22.22 1.52,6.48 4.06,3.94 32.86,3.94 STM_IO_2.12 ; R35.1 R34.1 v1(30.23,18.01) ; OSC1.24 19.75,20.06 18.9,19.21 C3.2 18.71,18.42 19.09,18.03 v1(20.07,18.03) ; R29.2 30.01,31.34
  vias: v1(29.37,16.48) v1(29.9,31.34) v1(32,26.56)
A+: length 16.2
  Top Layer w0.254: U24.26 17.18,14.45 18.08,14.45 19.29,13.24 19.29,10.97 16.04,7.72 10.88,7.72 MOTOR.3
A-: length 12.8
  Top Layer w0.254: U24.24 v1(18.08,13.44)
  Bottom Layer w0.254: MOTOR.4 14.48,6.6 19.05,11.18 19.05,13.08 18.69,13.44 v1(18.08,13.44) ; 12.42,6.1 12.26,6.1
B+: length 28.5
  Top Layer w0.254: MOTOR.1 4.76,4.91 5.12,4.54 13.63,4.54 19.65,10.56 19.65,14.78 17.19,17.24 16.55,17.24 16.17,16.86 U24.1
B-: length 12.9
  Top Layer w0.254: U24.21 16.17,9.24 15.16,8.23 7.74,8.23 7.26,7.75 MOTOR.2
BOOT0: length 7.6
  Top Layer w0.127: OSC1.44 29.31,23.58 34.6,23.58 35.85,22.33 36.37,22.33
CLK: length 2.8
  Top Layer w0.152: 12.17,12.94 9.71,12.94 TMC_SET.12
DIAG: length 3.3
  Top Layer w0.152: U24.11 10.71,13.94 TMC_SET.10
DIR.1: length 26.3
  Top Layer w0.127: OSC1.13 19.85,25.56 18.84,26.58 18.84,30.3 18.69,30.45 11.6,30.45 11.35,30.2 11.35,27.95 10.03,26.64 8.68,26.64 8.3,26.26 8.3,21.69 TMC_SET.5
DIR.2: length 15.9
  Top Layer w0.152: U24.19 15.17,10.63 v1(15.41,10.39)
  Bottom Layer w0.152: TMC_SET.6 10.84,18.89 10.84,12.04 13.25,9.62 14.65,9.62 v1(15.41,10.39)
EC_CH1: length 15.6
  Top Layer w0.127: OSC1.42 30.79,22.56 31.03,22.32 31.92,22.32 v1(32.05,22.45) ; 41.02,19.35 40.94,19.43 v1(40.94,21.82)
  Bottom Layer w0.127: v1(40.94,21.82) 39.41,23.34 32.43,23.34 32.05,22.96 v1(32.05,22.45)
EC_CH2: length 17.8
  Top Layer w0.127: v1(43.6,21.82) 43.6,19.39 EC_CH.1 ; v1(31.41,22.96) 31.31,23.06 29.29,23.06
  Bottom Layer w0.127: v1(31.41,22.96) 32.05,23.59 41.83,23.59 v1(43.6,21.82)
EN.1: length 23.2
  Top Layer w0.127: TMC_SET.1 6.9,26.2 7.85,27.15 9.82,27.15 10.81,28.14 10.81,30.43 11.35,30.96 18.94,30.96 19.35,30.56 19.35,29.06 19.98,28.42 22.52,28.42 22.79,28.15 22.79,27.06
EN.2: length 13.7
  Top Layer w0.152: U24.2 15.66,16.45 v1(15.66,17.24)
  Bottom Layer w0.152: TMC_SET.2 10.97,23.85 14.78,23.85 15.66,22.96 v1(15.66,17.24)
IDX: length 6
  Top Layer w0.152: U24.12 10.58,13.44 10.08,13.94 8.17,13.94 TMC_SET.9
MS1: length 4.5
  Top Layer w0.152: TMC_SET.8 10.97,16.23 10.97,15.21 11.23,14.94 12.17,14.94
MS2: length 7.3
  Top Layer w0.152: TMC_SET.7 8.17,16.48 10.2,16.48 10.56,16.13 10.56,14.98 11.1,14.44 U24.10
PA4: length 25.7
  Top Layer w0.127: 22.01,25.37 21.71,25.06 20.79,25.06
  Bottom Layer w0.127: STM_IO_1.7 39.06,16.71 37.89,17.88 35.04,17.88 33.39,19.53 30.27,19.53 23.79,26.01 22.52,26.01 v1(22.01,25.5)
PA5: length 23.4
  Top Layer w0.127: OSC1.15 21.97,24.56 v1(22.78,25.37)
  Bottom Layer w0.127: v1(22.78,25.37) 23.03,25.63 23.81,25.63 30.16,19.28 33.32,19.28 34.97,17.62 36.11,17.62 36.52,17.22 STM_IO_1.9
PA6: length 21.1
  Top Layer w0.127: 20.79,24.06 22.36,24.06 23.16,24.86 v1(23.41,24.86)
  Bottom Layer w0.127: v1(23.41,24.86) 24.22,24.86 30.06,19.02 33.19,19.02 33.98,18.24 STM_IO_1.11
PA7: length 45.2
  Top Layer w0.127: OSC1.17 22.87,23.56 v1(23.28,23.97)
  Bottom Layer w0.127: 46.68,7.34 44.24,9.78 22.44,9.78 20.42,11.79 20.42,14.56 20.71,14.86 21.85,14.86 23.77,16.77 23.77,19.12 23.79,19.15 23.79,23.47 v1(23.28,23.97)
PA11: length 29.1
  Top Layer w0.127: STM_IO_2.4 44.14,5.18 42.84,6.48 42.84,8.59 42.16,9.27 32.27,9.27 30.27,11.28 30.27,14.45 30.14,14.58 26.33,14.58 25.79,15.12 OSC1.32
PA12: length 31.2
  Top Layer w0.127: OSC1.33 26.29,15.38 26.71,14.96 30.27,14.96 30.65,14.58 30.65,11.28 32.4,9.53 44.58,9.53 45.38,8.72 45.38,6.35 STM_IO_2.2
PA15: length 16.9
  Top Layer w0.127: OSC1.38 30.41,20.56 31.06,21.21 34.69,21.21 35.48,20.42 35.48,19.4 35.22,19.15 35.22,12.14 STM_IO_1.12
PB1: length 41.8
  Top Layer w0.127: v1(22.14,22.96) 21.75,22.56 OSC1.19
  Bottom Layer w0.127: v1(22.14,22.96) 23.16,22.96 23.54,22.58 23.54,16.86 21.76,15.08 20.62,15.08 20.19,14.66 20.19,11.7 22.37,9.53 41.95,9.53 44.14,7.34
PB3: length 18.9
  Top Layer w0.127: STM_IO_1.10 37.63,12.01 37.63,20.41 37.22,20.83 35.56,20.83 34.96,21.44 30.65,21.44 30.28,21.06 29.29,21.06
PB4: length 20.8
  Top Layer w0.127: OSC1.40 30.27,21.56 30.4,21.69 32.5,21.69 32.8,21.99 32.8,22.57 32.94,22.7 34.64,22.7 35.12,22.23 35.12,21.59 35.66,21.05 37.31,21.05 37.89,20.48 37.89,12.06 STM_IO_1.8
PB5: length 22.3
  Top Layer w0.127: 29.29,22.06 31.42,22.06 31.55,21.93 32.41,21.93 32.57,22.08 32.57,22.72 32.81,22.96 34.71,22.96 35.35,22.32 35.35,21.69 35.73,21.31 37.38,21.31 38.14,20.55 38.14,19.15 40.3,16.99 40.3,11.91 41.32,10.89 STM_IO_1.6
PB8: length 23.7
  Top Layer w0.127: STM_IO_1.4 44.14,11.25 42.84,12.55 42.84,14.83 38.52,19.15 38.52,21.94 37,23.47 35.22,23.47 34.35,24.33 33.29,24.33 33.02,24.06 29.29,24.06
PB9: length 26.3
  Top Layer w0.127: OSC1.46 34.51,24.56 35.35,23.72 37.89,23.72 38.91,22.7 38.91,19.28 43.22,14.96 44.75,14.96 45.38,14.32 45.38,12.42 46.68,11.12 STM_IO_1.2
PB10: length 38.4
  Top Layer w0.127: v1(22.4,22.07) 21.89,21.56 OSC1.21
  Bottom Layer w0.127: 41.6,7.34 39.66,9.27 22.3,9.27 19.94,11.63 19.94,14.73 20.55,15.34 21.63,15.34 23.28,16.99 23.28,21.82 23.03,22.07 v1(22.4,22.07)
PB11: length 34.3
  Top Layer w0.127: 20.79,21.06 v1(22.52,21.06)
  Bottom Layer w0.127: v1(22.52,21.06) 22.52,16.61 21.51,15.59 20.36,15.59 19.69,14.92 19.69,11.44 22.11,9.02 37.38,9.02 39.06,7.34
PB12: length 27.4
  Top Layer w0.127: OSC1.25 22.29,17.78 v1(21.76,17.24)
  Bottom Layer w0.127: 36.52,7.34 36.52,7.72 35.47,8.76 22.04,8.76 19.43,11.38 19.43,14.98 21.69,17.24 v1(21.76,17.24)
PB13: length 30.6
  Top Layer w0.127: STM_IO_2.10 35.34,6.22 21.6,6.22 19.94,7.89 19.94,16.31 20.24,16.61 21.89,16.61 22.79,17.52 OSC1.26
PB14: length 32.9
  Top Layer w0.127: OSC1.27 23.29,17.63 22.01,16.36 20.36,16.36 20.19,16.19 20.19,8.02 21.68,6.53 37.58,6.53 STM_IO_2.8
PB15: length 38.4
  Top Layer w0.127: OSC1.28 23.79,17.63 22.27,16.1 20.62,16.1 20.42,15.91 20.42,8.17 21.73,6.86 31.31,6.86 33.47,9.02 40,9.02 40.3,8.72 40.3,6.35 41.6,5.06 STM_IO_2.6
PC13: length 27.8
  Top Layer w0.127: 27.29,27.06 27.29,25.55 v1(27.6,25.25)
  Bottom Layer w0.127: v1(27.6,25.25) 27.6,23.34 30.65,20.29 33.7,20.29 35.35,18.64 38.21,18.64 40.87,15.97 42.95,15.97 43.66,15.26 46.09,15.26 46.65,14.7 46.65,13.46 STM_IO_1.1
PC14: length 25.5
  Top Layer w0.127: 26.79,27.06 v1(26.79,25.12)
  Bottom Layer w0.127: STM_IO_1.3 44.14,14.43 42.84,15.72 40.77,15.72 38.1,18.39 35.22,18.39 33.57,20.04 30.52,20.04 26.79,23.77 v1(26.79,25.12)
PC15: length 23.7
  Top Layer w0.127: v1(25.95,25.25) 26.29,25.59 26.29,27.06
  Bottom Layer w0.127: STM_IO_1.5 41.6,14.53 37.99,18.13 35.15,18.13 33.5,19.78 30.37,19.78 25.95,24.21 v1(25.95,25.25)
PWM1: length 34.9
  Top Layer w0.254: 23.29,27.06 23.29,28.41 22.9,28.8 20.24,28.8 19.78,29.26 19.78,35.46 20.74,36.42 41.81,36.42 42.59,35.64
PWM2: length 24.9
  Top Layer w0.254: PWM2.1 37.11,27.38 35.86,26.13 33.7,26.13 32.56,27.28 29.63,27.28 28.24,25.88 28.24,23.85 24.3,19.91 24.3,18.57 OSC1.29
REMOTE_IN: length 7.5
  Top Layer w0.127: R30.1 14.78,24.1 15.81,23.06 20.79,23.06
RST: length 20.3
  Top Layer w0.127: Key_rst.2 32.82,35.29 32.04,34.5 R29.1 32.04,29.74 C30.2
  Top Layer w0.152: C30.2 32.56,29.69 ; 24.79,27.06 v1(24.79,25.88)
  Bottom Layer w0.127: v1(24.79,25.88) 28.11,25.88 30.14,27.91 32.3,27.91 32.68,28.29 v1(32.68,29.69)
RX: length 5.4
  Top Layer w0.127: USART.3 24.03,13.92 24.79,14.69 OSC1.30
STEP.1: length 24.3
  Top Layer w0.127: TMC_SET.3 8.04,23.97 8.04,26.39 8.55,26.9 9.93,26.9 11.09,28.06 11.09,30.35 11.45,30.71 18.84,30.71 19.09,30.45 19.09,28.93 19.85,28.17 22.01,28.17 22.29,27.89 22.29,27.06
STEP.2: length 15.3
  Top Layer w0.152: U24.16 v1(13.67,10.39)
  Bottom Layer w0.152: v1(13.67,10.39) 11.35,12.71 11.35,20.93 TMC_SET.4
SWCLK: length 19.3
  Top Layer w0.127: 30.89,19.52 30.89,20.17 31.4,20.67 v1(34.08,20.67)
  Top Layer w0.152: 30.89,19.52 30.35,20.06 OSC1.37
  Bottom Layer w0.127: v1(34.08,20.67) 34.59,21.18 45.51,21.18 46.4,22.07 JTAG.2
SWDIO: length 23.2
  Top Layer w0.127: v1(34.84,20.04) 34.32,19.52 32.43,19.52
  Top Layer w0.152: OSC1.34 26.79,19.48 27.22,19.91 27.86,19.91 29,18.77 31.67,18.77 32.43,19.52
  Bottom Layer w0.127: JTAG.3 45.51,20.93 35.73,20.93 v1(34.84,20.04)
TX: length 5.7
  Top Layer w0.127: OSC1.31 25.29,14.71 USART.2
X1: length 9.8
  Top Layer w0.127: 25.79,27.06 25.79,28.97 27.58,30.76 27.58,30.98 26.33,32.23 26.33,33.96
  Top Layer w0.152: C1.2 27.87,33.96 26.33,33.96
  Top Layer w0.254: 26.33,33.96 R1.1
X2: length 9.8
  Top Layer w0.127: 25.29,27.06 25.29,28.94 23.48,30.75 23.48,31.16 24.78,32.45 R1.2
  Top Layer w0.152: C2.2 23.19,34 R1.2
$1N1980: length 8.1
  Top Layer w0.508: L2.1 8.17,42.44 8.17,39.98 9.31,38.84 C20.1 10.96,36.99 11.28,37.32
$1N1981: length 2.4
  Top Layer w0.254: 11.28,35.02 11.28,35.34 11.04,35.59 C20.2
$1N1982: length 8.1
  Top Layer w0.254: U18.4 13.63,37.32 13.89,37.06 13.89,34.25 14.35,33.78 16.38,33.78 16.93,34.33 R15.1
$1N1985: length 1.7
  Top Layer w0.254: +5V.2 2.83,26.28 R24.1
$1N3570: length 2
  Top Layer w0.254: U21.4 4.27,28.28 C25.1
$1N3715: length 1.7
  Top Layer w0.254: 3.3V.2 2.83,21.83 R26.1
$1N6287: length 4.6
  Top Layer w0.152: R30.2 R31.1 17.62,27.44 U23.1
$1N6481: length 1.7
  Top Layer w0.254: R32.1 2.83,17.52 7.4V.2
$1N6675: length 4.5
  Top Layer w0.127: R33.2 20.79,22.07 20.79,22.06
$1N7825: length 5.4
  Top Layer w0.152: U24.5 14.17,17.4 14.9,18.13 15.79,18.13 15.92,18.26 15.92,19.36 C32.2
$1N7836: length 4
  Top Layer w0.152: U24.4 14.67,17.39 15.16,17.88 16.43,17.88 16.78,18.24 C32.1
$1N7919: length 3
  Top Layer w0.152: C33.2 15.09,18.83 13.67,17.41 U24.6
$1N8038: length 5.9
  Top Layer w0.152: U24.8 11.5,15.44 11.35,15.59 11.35,18.22 C35.2 C34.2
$1N10736: length 12.2
  Top Layer w0.254: C22.1 7.22,36.68 R25.1 5.77,36.51 R17.1 6.91,33.88 12.74,33.88 13.19,34.32 U18.3
$1N12968: length 9.2
  Top Layer w0.508: POWER_7.4.1 40.32,41.63 SW2.1

## Copper pours and planes (outline as drawn; the poured copper is in the pictures)
+5V on POWER: 0.26,49.74 19.3,49.74 19.3,8.89 0.26,8.89
+7.4V on POWER: 16.52,49.74 49.74,49.74 49.74,37.58 16.52,37.58
GND on GND: 0.26,49.74 49.74,49.74 49.74,0.26 0.26,0.26
VCC on POWER: 0.26,37.33 49.74,37.33 49.74,0.26 0.26,0.26

Small or netless copper shapes (teardrops, artwork), in the pictures only: 24 on POWER, 47 on GND

## Text on the board
Top Silkscreen Layer: MS2 | IDX | GND | DIAG | CLK | MS1 | VCC | A15 | A6 | B12 | B13 | A5 | B3 | B11 | B14 | A4 | B4 | B10 | B15 | C15 | B5 | C14 | A11 | B8 | B1 | C13 | A12 | B9 | A7 | STEP | DIR | EN | 1 | 0 | RX | TX | EC1 | + | - | EC2 | DIO | STM32_IO | B+ | B- | A+ | A-
